# Altium schematic sheet P12-HDMI.SchDoc
size 513 x 386 mm
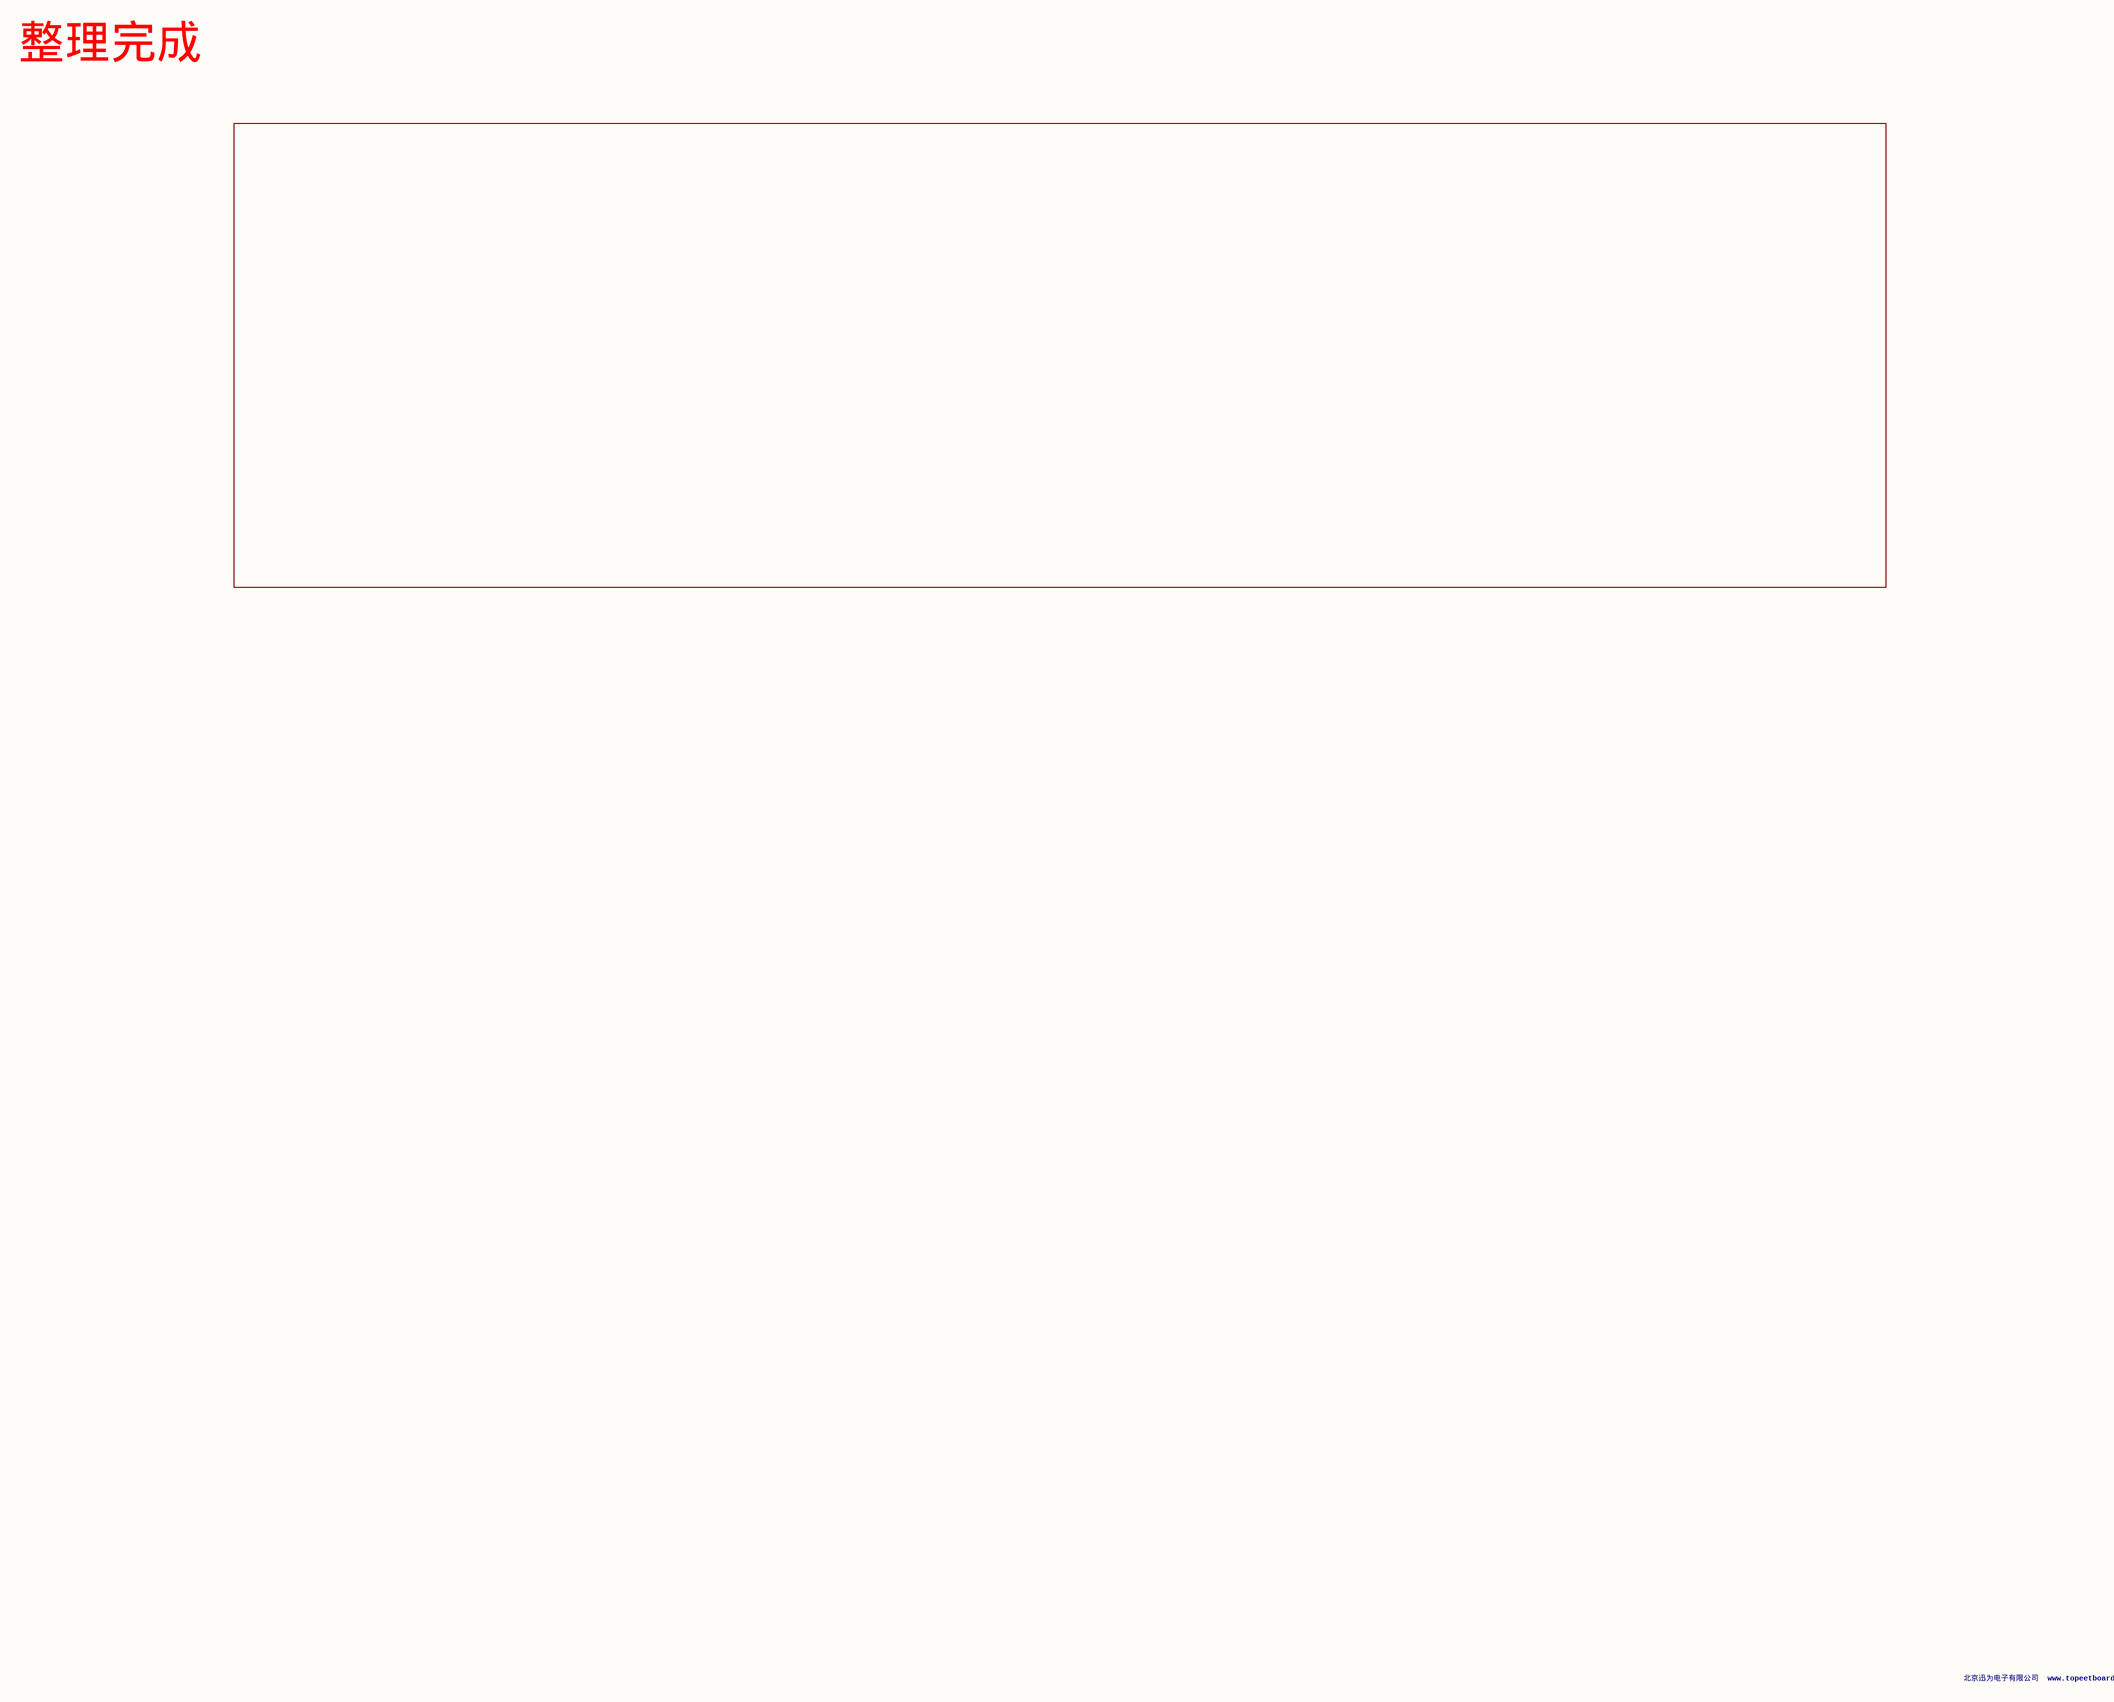
[diagram p0: P12-HDMI.SchDoc]

## Notes on the sheet
- 整理完成
- 北京迅为电子有限公司  www.topeetboard.com